# Altium schematic sheet MX1508.SchDoc
size A4
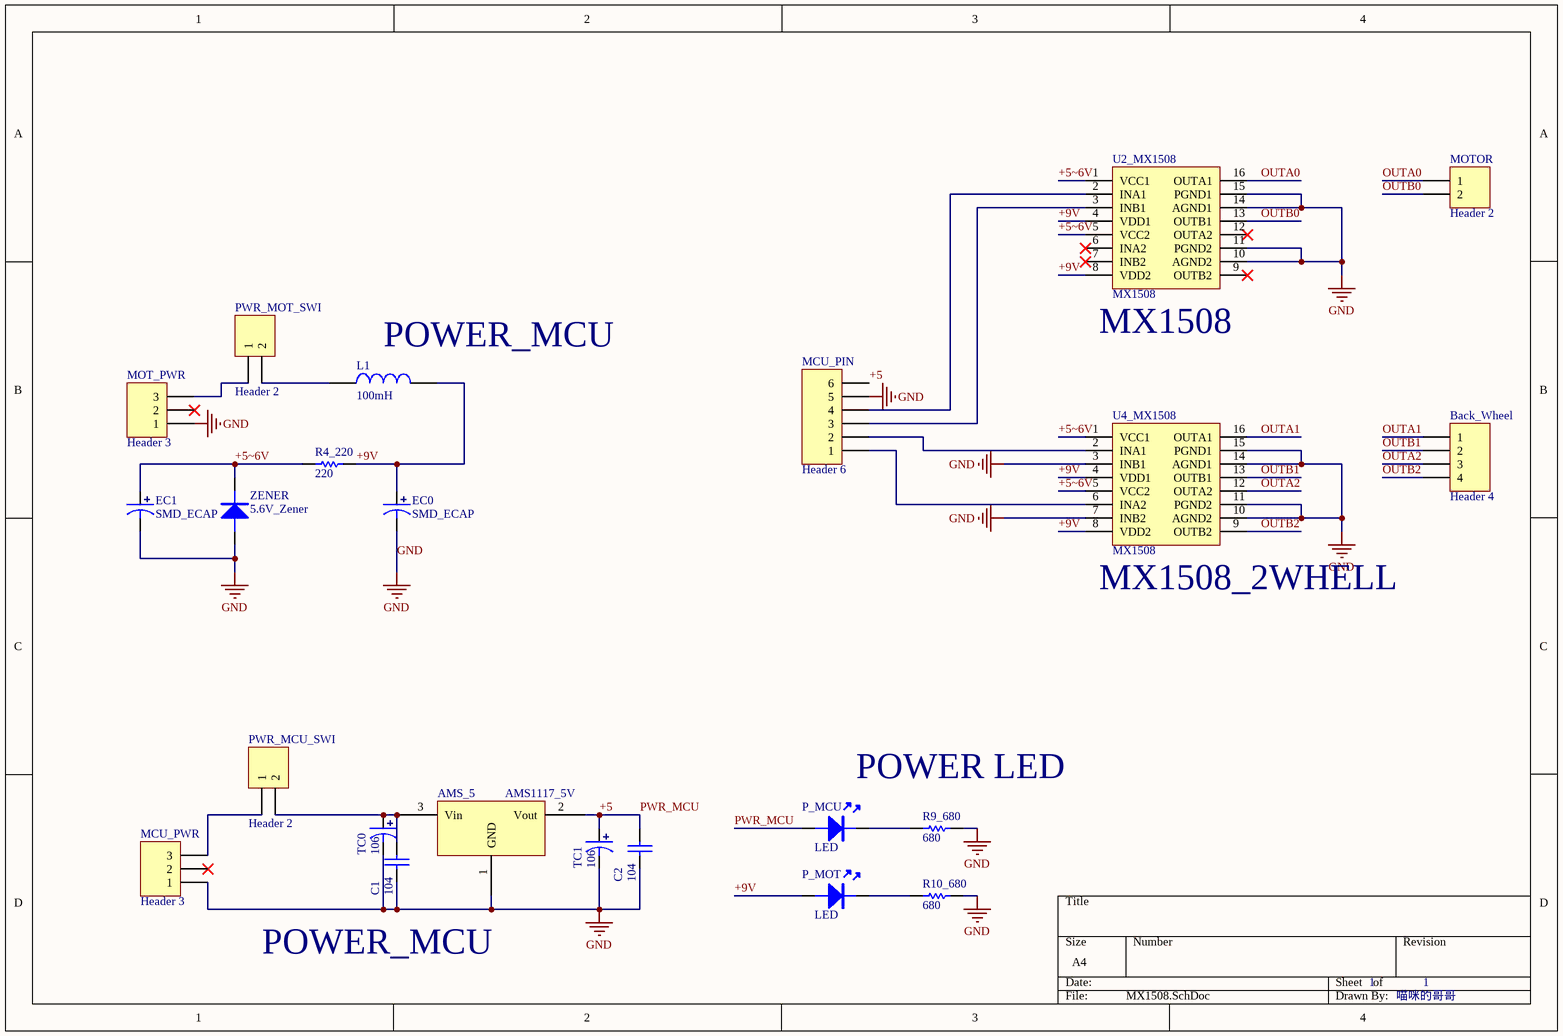
[diagram p0: MX1508.SchDoc]

## Parts
AMS_5  AMS1117_5V  [SOT223]
Back_Wheel  Header 4  [HDR1X4]
C1  104  [0402C]
C2  104  [0402C]
EC0  SMD_ECAP  [SMD-EC6.3X6.3X10]
EC1  SMD_ECAP  [SMD-EC6.3X6.3X10]
L1  100mH  [0603L]
MCU_PIN  Header 6  [HDR1X6]
MCU_PWR  Header 3  [HDR1X3]
MOT_PWR  Header 3  [HDR1X3]
MOTOR  Header 2  [HDR1X2]
P_MCU  LED  [LED-0603Y]
P_MOT  LED  [LED-0603Y]
PWR_MCU_SWI  Header 2  [HDR1X2]
PWR_MOT_SWI  Header 2  [HDR1X2]
R4_220  220  [0402R]
R9_680  680  [0402R]
R10_680  680  [0402R]
TC0  106  [TAJ-A/3216]
TC1  106  [TAJ-A/3216]
U2_MX1508  MX1508  [SOP16]
U4_MX1508  MX1508  [SOP16]
ZENER  5.6V_Zener  [LL34]

## Nets
GND: AMS_5.1(GND) C1.1 C2.1 EC0.2 EC1.2 MCU_PIN.5 MCU_PWR.1 MOT_PWR.1 R9_680.1 R10_680.1 TC0.2 TC1.2 U2_MX1508.10(AGND2) U2_MX1508.11(PGND2) U2_MX1508.14(AGND1) U2_MX1508.15(PGND1) U4_MX1508.3(INB1) U4_MX1508.7(INB2) U4_MX1508.10(AGND2) U4_MX1508.11(PGND2) U4_MX1508.14(AGND1) U4_MX1508.15(PGND1) ZENER.A
+5: AMS_5.2(Vout) C2.2 MCU_PIN.6 P_MCU.A TC1.1  [also labelled PWR_MCU]
+5~6V: EC1.1 R4_220.1 U2_MX1508.1(VCC1) U2_MX1508.5(VCC2) U4_MX1508.1(VCC1) U4_MX1508.5(VCC2) ZENER.K
+9V: EC0.1 L1.2 P_MOT.A R4_220.2 U2_MX1508.4(VDD1) U2_MX1508.8(VDD2) U4_MX1508.4(VDD1) U4_MX1508.8(VDD2)
OUTA0: MOTOR.1 U2_MX1508.16(OUTA1)
OUTA1: Back_Wheel.1 U4_MX1508.16(OUTA1)
OUTA2: Back_Wheel.3 U4_MX1508.12(OUTA2)
OUTB0: MOTOR.2 U2_MX1508.13(OUTB1)
OUTB1: Back_Wheel.2 U4_MX1508.13(OUTB1)
OUTB2: Back_Wheel.4 U4_MX1508.9(OUTB2)
NetAMS_5_3: AMS_5.3(Vin) C1.2 PWR_MCU_SWI.2 TC0.1
NetL1_1: L1.1 PWR_MOT_SWI.2
NetMCU_PIN_1: MCU_PIN.1 U4_MX1508.6(INA2)
NetMCU_PIN_2: MCU_PIN.2 U4_MX1508.2(INA1)
NetMCU_PIN_3: MCU_PIN.3 U2_MX1508.3(INB1)
NetMCU_PIN_4: MCU_PIN.4 U2_MX1508.2(INA1)
NetMCU_PWR_3: MCU_PWR.3 PWR_MCU_SWI.1
NetMOT_PWR_3: MOT_PWR.3 PWR_MOT_SWI.1
NetP_MCU_K: P_MCU.K R9_680.2
NetP_MOT_K: P_MOT.K R10_680.2

Not connected (* = marked no-connect by the designer): MCU_PWR 2*; MOT_PWR 2*; U2_MX1508 6(INA2)* 7(INB2)* 9(OUTB2)* 12(OUTA2)*

## Notes on the sheet
- (near L1) POWER_MCU
- (near U2_MX1508) MX1508
- (near U4_MX1508) MX1508_2WHELL
- POWER LED
- POWER_MCU
- 1
- 喵咪的哥哥

## Library data of the parts
AMS_5 = AMS1117: 三端稳压芯片
Back_Wheel = Header 4: Header, 4-Pin; LatestRevisionDate: 17-Jul-2002; LatestRevisionNote: Re-released for DXP Platform.; Publisher: Altium Limited
C1 C2 = CAP: 无极性电容
EC0 EC1 = SMD_ECAP: 贴片电解电容
L1 = INDUCTOR
MCU_PIN = Header 6: Header, 6-Pin; LatestRevisionDate: 17-Jul-2002; LatestRevisionNote: Re-released for DXP Platform.; Publisher: Altium Limited
MCU_PWR MOT_PWR = Header 3: Header, 3-Pin; LatestRevisionDate: 17-Jul-2002; LatestRevisionNote: Re-released for DXP Platform.; Publisher: Altium Limited
MOTOR PWR_MCU_SWI PWR_MOT_SWI = Header 2: Header, 2-Pin; LatestRevisionDate: 17-Jul-2002; LatestRevisionNote: Re-released for DXP Platform.; Publisher: Altium Limited
R4_220 R9_680 R10_680 = RES
TC0 TC1 = TCAP: 钽电容
ZENER = DIODE: 普通二极管